# EasyEDA Pro project ProPrj_FC_1_2025-02-16.epro

# Schematic Flight controller_1
Board Name: Board1; Create Date: 2025-02-11; Page Name: P1; Project Name: FC_1; Schematic Name: Flight controller_1; Update Date: 2025-02-16; Company: EasyEDA.com; Page Size: A4; Version: V1.0
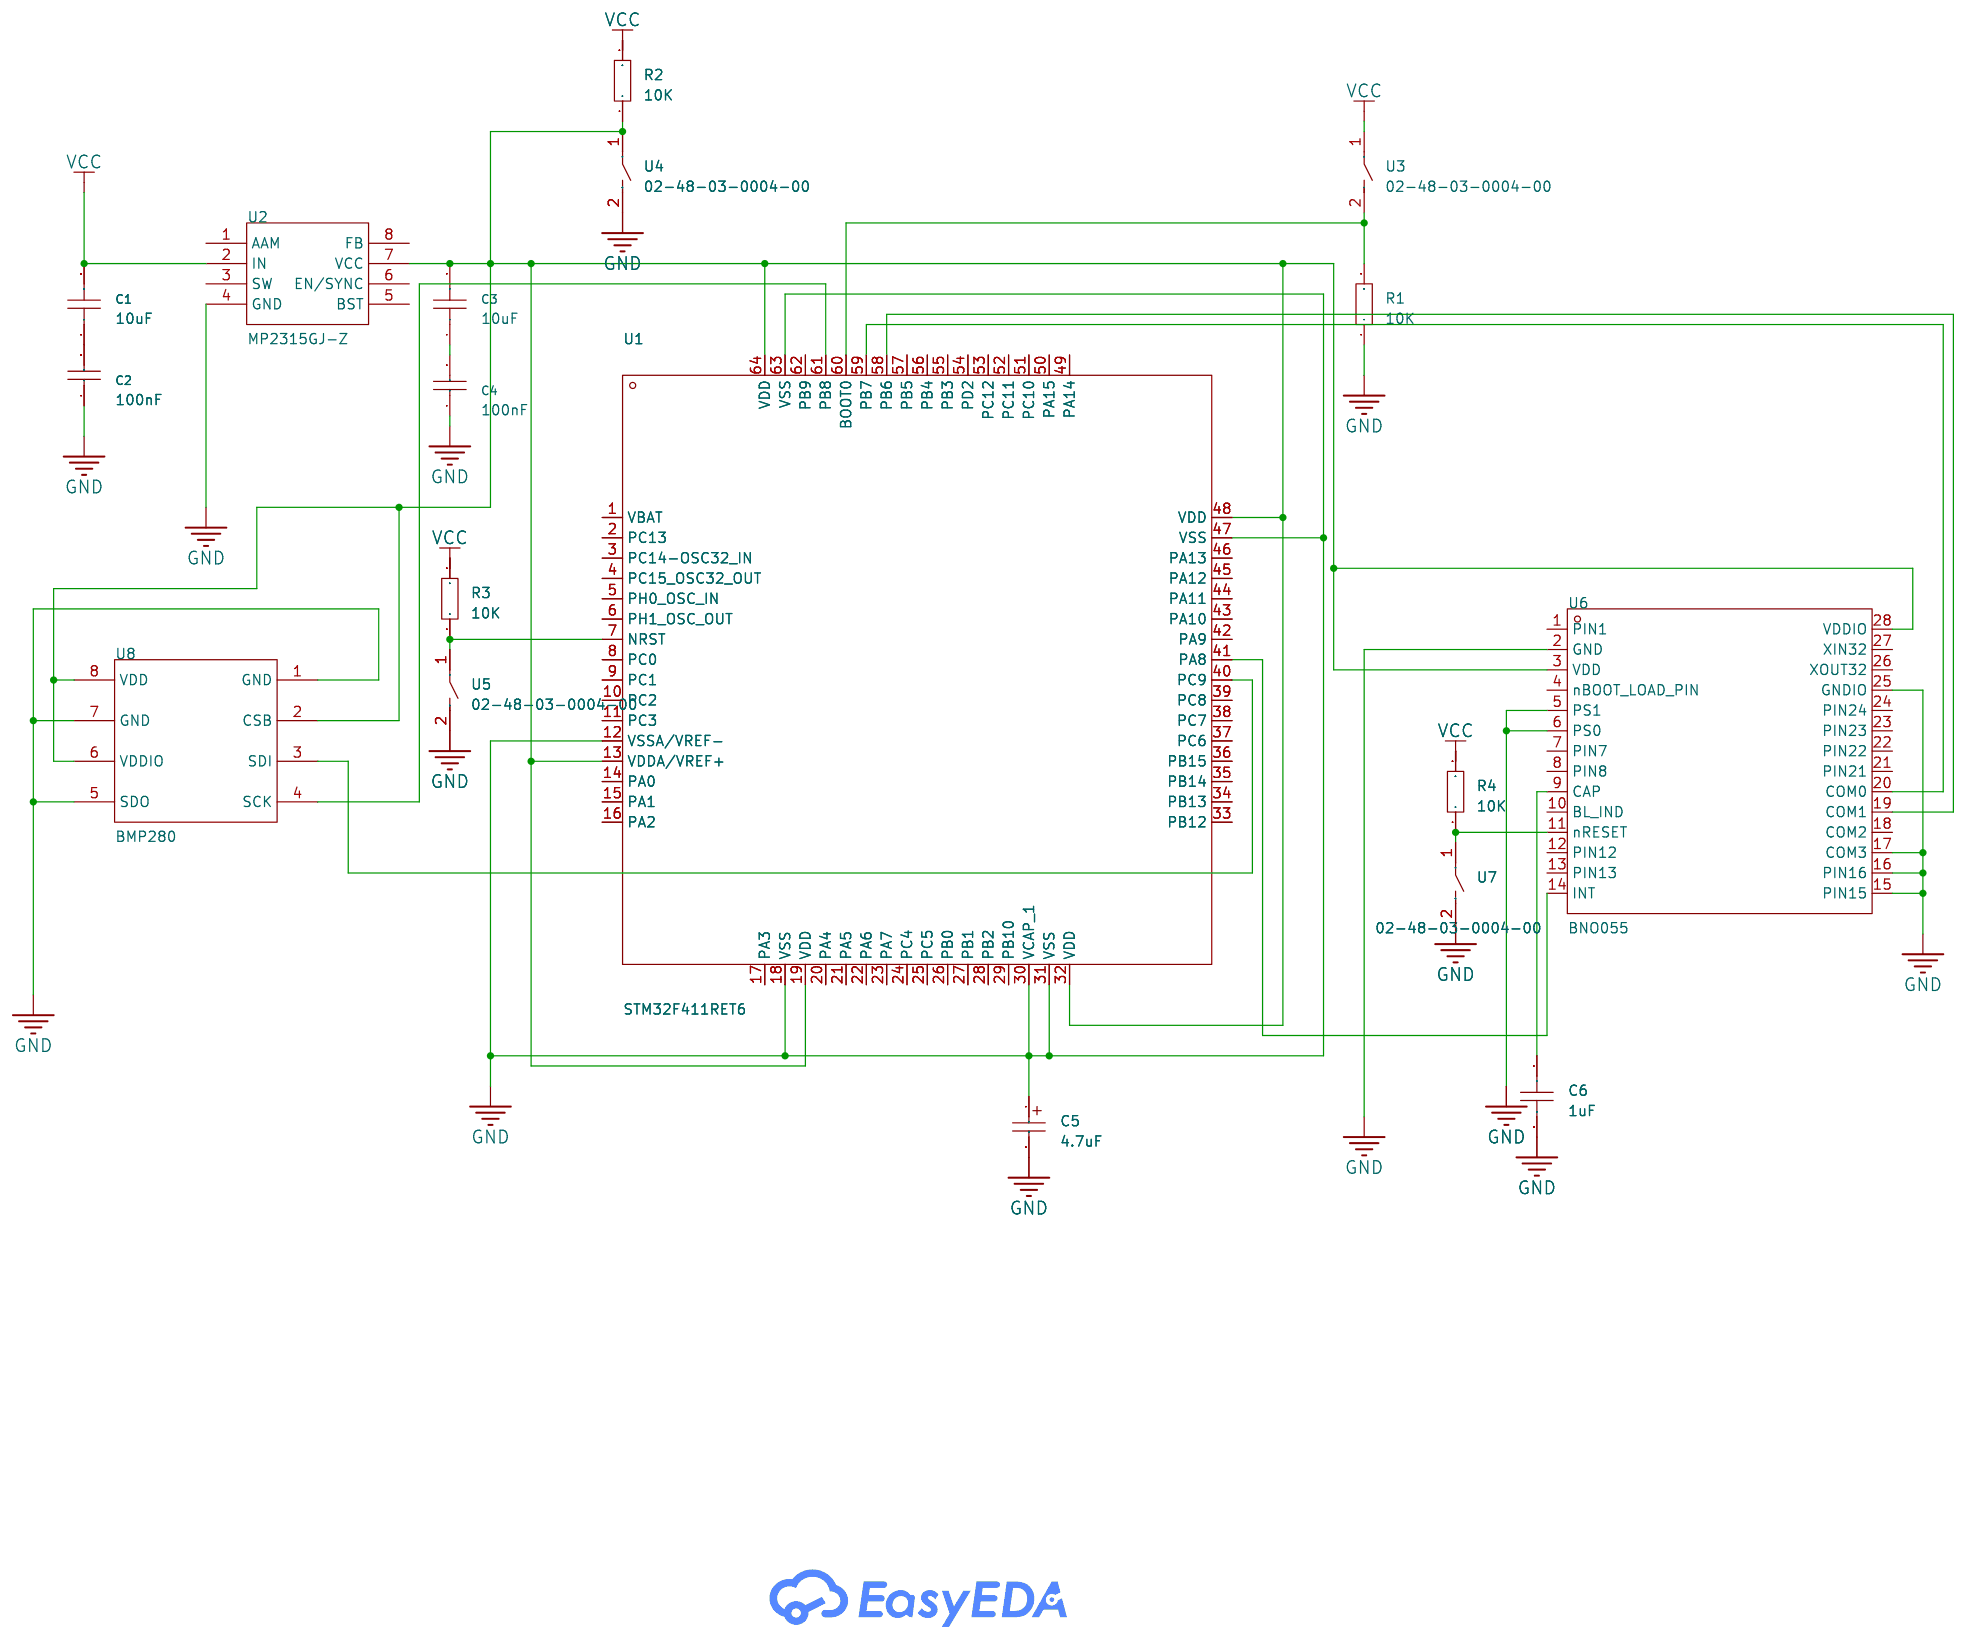
[diagram p0: schematic sheet]

## Parts
C1  10uF  [C0603]
C2  100nF  [C1206]
C3  10uF  [C0603]
C4  100nF  [C1206]
C5  4.7uF  [CAP-SMD_L3.5-W2.8]
C6  1uF  [C0603]
R1  10K  [R0603]
R2  10K  [R0603]
R3  10K  [R0603]
R4  10K  [R0603]
U1  STM32F411RET6  [LQFP-64_L10.0-W10.0-P0.50-LS12.0-BL]
U2  MP2315GJ-Z  [TSOT-23-8_L2.9-W1.6-P0.65-LS2.8-BR]
U3  02-48-03-0004-00  [KEY-SMD_L6.0-W3.5-LS8.0-1]
U4  02-48-03-0004-00  [KEY-SMD_L6.0-W3.5-LS8.0-1]
U5  02-48-03-0004-00  [KEY-SMD_L6.0-W3.5-LS8.0-1]
U6  BNO055  [LGA-28_L5.2-W3.8-P0.50-BL]
U7  02-48-03-0004-00  [KEY-SMD_L6.0-W3.5-LS8.0-1]
U8  BMP280  [LGA-8_L2.5-W2.0-P0.65_AMP6127]

## Library data of the parts
C1 C3 = CL10A106MA8NRNC: Capacitance: Tolerance:±20% Tolerance:±20% Voltage Rated: Temperature Coefficient:; LCSC Part Name: 10uF ±20% 25V; Supplier Part: C96446; Manufacturer: SAMSUNG(三星); Supplier Footprint: 0603; JLCPCB Part Class: Basic Part; Datasheet: https://atta.szlcsc.com/upload/public/pdf/source/20160218/1457707763339.pdf; Supplier: LCSC; Tolerance: ±20%
C2 C4 = CL31B104KBCNNNC: Capacitance: Tolerance:±10% Tolerance:±10% Voltage Rated: Temperature Coefficient:; LCSC Part Name: 100nF ±10% 50V; Supplier Part: C24497; Manufacturer: SAMSUNG(三星); Supplier Footprint: 1206; JLCPCB Part Class: Basic Part; Datasheet: https://atta.szlcsc.com/upload/public/pdf/source/20160218/1457707763339.pdf; Supplier: LCSC; Tolerance: ±10%
C5 = CA45B-B-35V-4.7UF-K: Capacitance: Tolerance:±10% Tolerance:±10% Rated Voltage: Operating Temperature:-55℃~+125℃ Operating Temperature:-55℃~+125℃; LCSC Part Name: 4.7uF ±10% 35V; Supplier Part: C2976929; Manufacturer: CEC(振华新云); Supplier Footprint: SMD,2.8x3.5mm; JLCPCB Part Class: Extended Part; Datasheet: https://atta.szlcsc.com/upload/public/pdf/source/20220222/C2C5F368BEBB90E653B4407F98E5644A.pdf; Supplier: LCSC; Tolerance: ±10%; Operating Temperature: -55℃~+125℃
C6 = CAP_0603: Supplier Footprint: 0603
R1-R4 = Res_0603: Supplier Footprint: 0603
U1 = STM32F411RET6: CPU Core:ARM-M4 CPU Maximum Speed:100MHz Program Storage Size:512KB Program Memory Type:FLASH Number of I/O:50 ADC (Bit):12bit Low Voltage Detection Threshold:1.7V~3.6V Low Voltage Detection Threshold:1.7V~3.6V Application Area:-; LCSC Part Name: 带DSP和FPU的高性能基本型系列ARM Cortex-M4 MCU，具有512 KB Flash、100 MHz CPU和ART加速器; Supplier Part: C94355; Manufacturer: ST(意法半导体); Supplier Footprint: LQFP-64(10x10); JLCPCB Part Class: Extended Part; Datasheet: https://atta.szlcsc.com/upload/public/pdf/source/20170908/C94355_1504870172026958155.pdf; Supplier: LCSC; CPU Core: ARM-M4; CPU Maximum Speed: 100MHz; Program Storage Size: 512KB; Program Memory Type: FLASH; Number of I/O: 50; ADC (Bit): 12bit; Low Voltage Detection Threshold: 1.7V~3.6V
U2 = MP2315GJ-Z: Function:Step-down type Output Type:- Input Voltage:4.5V~24V Input Voltage:4.5V~24V Output Voltage:800mV~22.8V Output Voltage:800mV~22.8V Output Current:3A Switching Frequency:500kHz Switching Frequency:500kHz Operating Temperature:-40℃~+125℃ Operating Te; LCSC Part Name: 高效率3A 24V 500kHz同步降压转换器; Supplier Part: C45889; Manufacturer: MPS(芯源); Supplier Footprint: TSOT-23-8; JLCPCB Part Class: Extended Part; Datasheet: https://atta.szlcsc.com/upload/public/pdf/source/20240315/E986BDF075E08D3649664A84BD5F173B.pdf; Supplier: LCSC; Function: Step-down type; Input Voltage: 4.5V~24V; Output Voltage: 800mV~22.8V; Output Current: 3A; Switching Frequency: 500kHz; Operating Temperature: -40℃~+125℃; Synchronous Rectification: Yes; Number of Outputs: 1; Topology: Step-down
U3-U5 U7 = 02-48-03-0004-00: Supplier Part: C9900014407; Supplier Footprint: SWITCH2-01; JLCPCB Part Class: Extended Part; Supplier: LCSC
U6 = BNO055: Supplier Part: C93216; Manufacturer: Bosch(博世); Supplier Footprint: LGA-28(3.8x5.2); JLCPCB Part Class: Extended Part; Datasheet: https://atta.szlcsc.com/upload/public/pdf/source/20170908/C93216_1504870163958958144.pdf; Supplier: LCSC
U8 = BMP280: LCSC Part Name: BMP280 停产; Supplier Part: C83291; Manufacturer: Bosch(博世); Supplier Footprint: LGA-8(2x2.5); JLCPCB Part Class: Extended Part; Datasheet: https://atta.szlcsc.com/upload/public/pdf/source/20200702/C83291_F39E84AB7DFC569A4C7554F8659640A1.pdf; Supplier: LCSC

## Nets
GND: C2.1 C4.1 C5.1 C5.2 C6.2 R1.1 U1.12(VSSA/VREF-) U1.18(VSS) U1.30(VCAP_1) U1.31(VSS) U1.47(VSS) U1.63(VSS) U2.4(GND) U4.2 U5.2 U6.2(GND) U6.5(PS1) U6.6(PS0) U6.15(PIN15) U6.16(PIN16) U6.17(COM3) U6.25(GNDIO) U7.2 U8.1(GND) U8.5(SDO) U8.7(GND)
VCC: C1.2 R2.2 R3.2 R4.2 U2.2(IN) U3.1
Net-(C1-1): C1.1 C2.2
Net-(C3-1): C3.1 C4.2
Net-(C3-2): C3.2 R2.1 U1.13(VDDA/VREF+) U1.19(VDD) U1.32(VDD) U1.48(VDD) U1.64(VDD) U2.7(VCC) U4.1 U6.3(VDD) U6.28(VDDIO) U8.2(CSB) U8.6(VDDIO) U8.8(VDD)
Net-(C6-1): C6.1 U6.9(CAP)
Net-(R1-2): R1.2 U1.60(BOOT0) U3.2
Net-(R3-1): R3.1 U1.7(NRST) U5.1
Net-(R4-1): R4.1 U6.11(nRESET) U7.1
Net-(U1-40): U1.40(PC9) U8.3(SDI)
Net-(U1-41): U1.41(PA8) U6.14(INT)
Net-(U1-58): U1.58(PB6) U6.19(COM1)
Net-(U1-59): U1.59(PB7) U6.20(COM0)
Net-(U1-61): U1.61(PB8) U8.4(SCK)

Not connected (* = marked no-connect by the designer): U1 1(VBAT) 2(PC13) 3(PC14-OSC32_IN) 4(PC15_OSC32_OUT) 5(PH0_OSC_IN) 6(PH1_OSC_OUT) 8(PC0) 9(PC1) 10(PC2) 11(PC3) 14(PA0) 15(PA1) 16(PA2) 17(PA3) 20(PA4) 21(PA5) 22(PA6) 23(PA7) 24(PC4) 25(PC5) 26(PB0) 27(PB1) 28(PB2) 29(PB10) 33(PB12) 34(PB13) 35(PB14) 36(PB15) 37(PC6) 38(PC7) 39(PC8) 42(PA9) 43(PA10) 44(PA11) 45(PA12) 46(PA13) 49(PA14) 50(PA15) 51(PC10) 52(PC11) 53(PC12) 54(PD2) 55(PB3) 56(PB4) 57(PB5) 62(PB9); U2 1(AAM) 3(SW) 5(BST) 6(EN/SYNC) 8(FB); U6 1(PIN1) 4(nBOOT_LOAD_PIN) 7(PIN7) 8(PIN8) 10(BL_IND) 12(PIN12) 13(PIN13) 18(COM2) 21(PIN21) 22(PIN22) 23(PIN23) 24(PIN24) 26(XOUT32) 27(XIN32)
